# Altium schematic sheet DSP_Board.SchDoc
size Letter
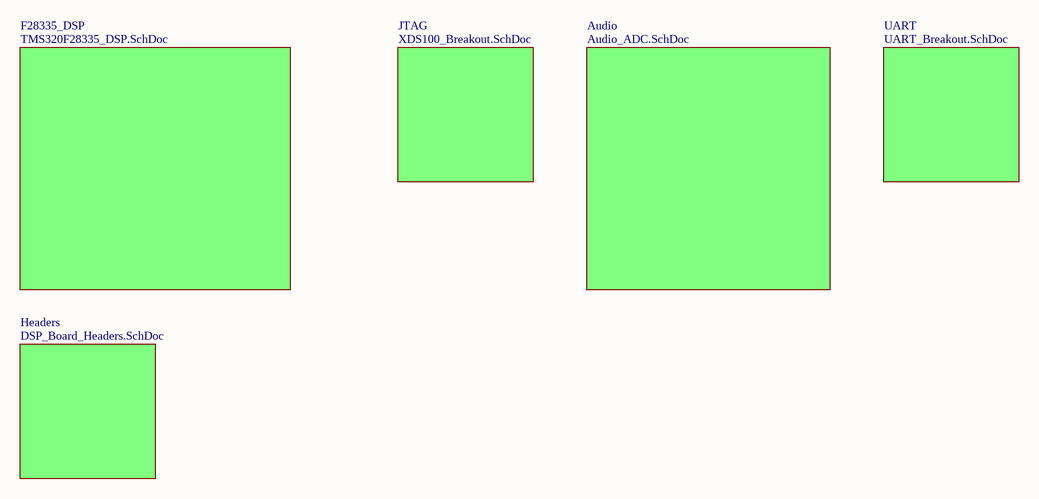
[diagram p0: DSP_Board.SchDoc]

## Sub-sheets
Audio = Audio_ADC.SchDoc: no entries
F28335_DSP = TMS320F28335_DSP.SchDoc: no entries
Headers = DSP_Board_Headers.SchDoc: no entries
JTAG = XDS100_Breakout.SchDoc: no entries
UART = UART_Breakout.SchDoc: no entries